# Altium schematic sheet Servos.SchDoc
size 101 x 127 mm; SheetNumber: 5; SheetTotal: 8
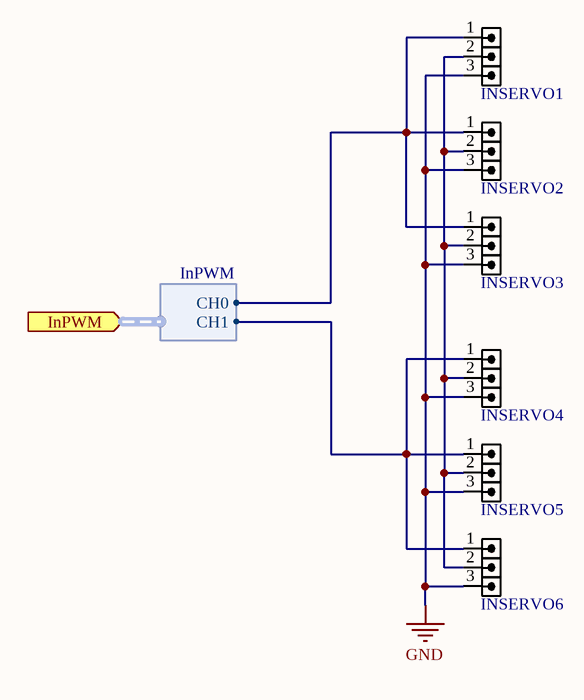
[diagram p0: Servos.SchDoc]

## Parts
INSERVO1  HDRM3  [HDR_M_1X3]  (value not drawn)
INSERVO2  HDRM3  [HDR_M_1X3]  (value not drawn)
INSERVO3  HDRM3  [HDR_M_1X3]  (value not drawn)
INSERVO4  HDRM3  [HDR_M_1X3]  (value not drawn)
INSERVO5  HDRM3  [HDR_M_1X3]  (value not drawn)
INSERVO6  HDRM3  [HDR_M_1X3]  (value not drawn)

## Ports
InPWM (in, harness InPWM)

## Harnesses
InPWM: CH0, CH1

## Nets
GND: INSERVO1.3 INSERVO2.3 INSERVO3.3 INSERVO4.3 INSERVO5.3 INSERVO6.3
NetINSERVO1_1: INSERVO1.1 INSERVO2.1 INSERVO3.1 ; port InPWM.CH0
NetINSERVO1_2: INSERVO1.2 INSERVO2.2 INSERVO3.2 INSERVO4.2 INSERVO5.2 INSERVO6.2
NetINSERVO4_1: INSERVO4.1 INSERVO5.1 INSERVO6.1 ; port InPWM.CH1

## Library data of the parts
INSERVO1-INSERVO6 = HDR_M_1X3: CONN, HEADER, Male, pitch: 2.54mm, 3POS; VALUE: HDRM3